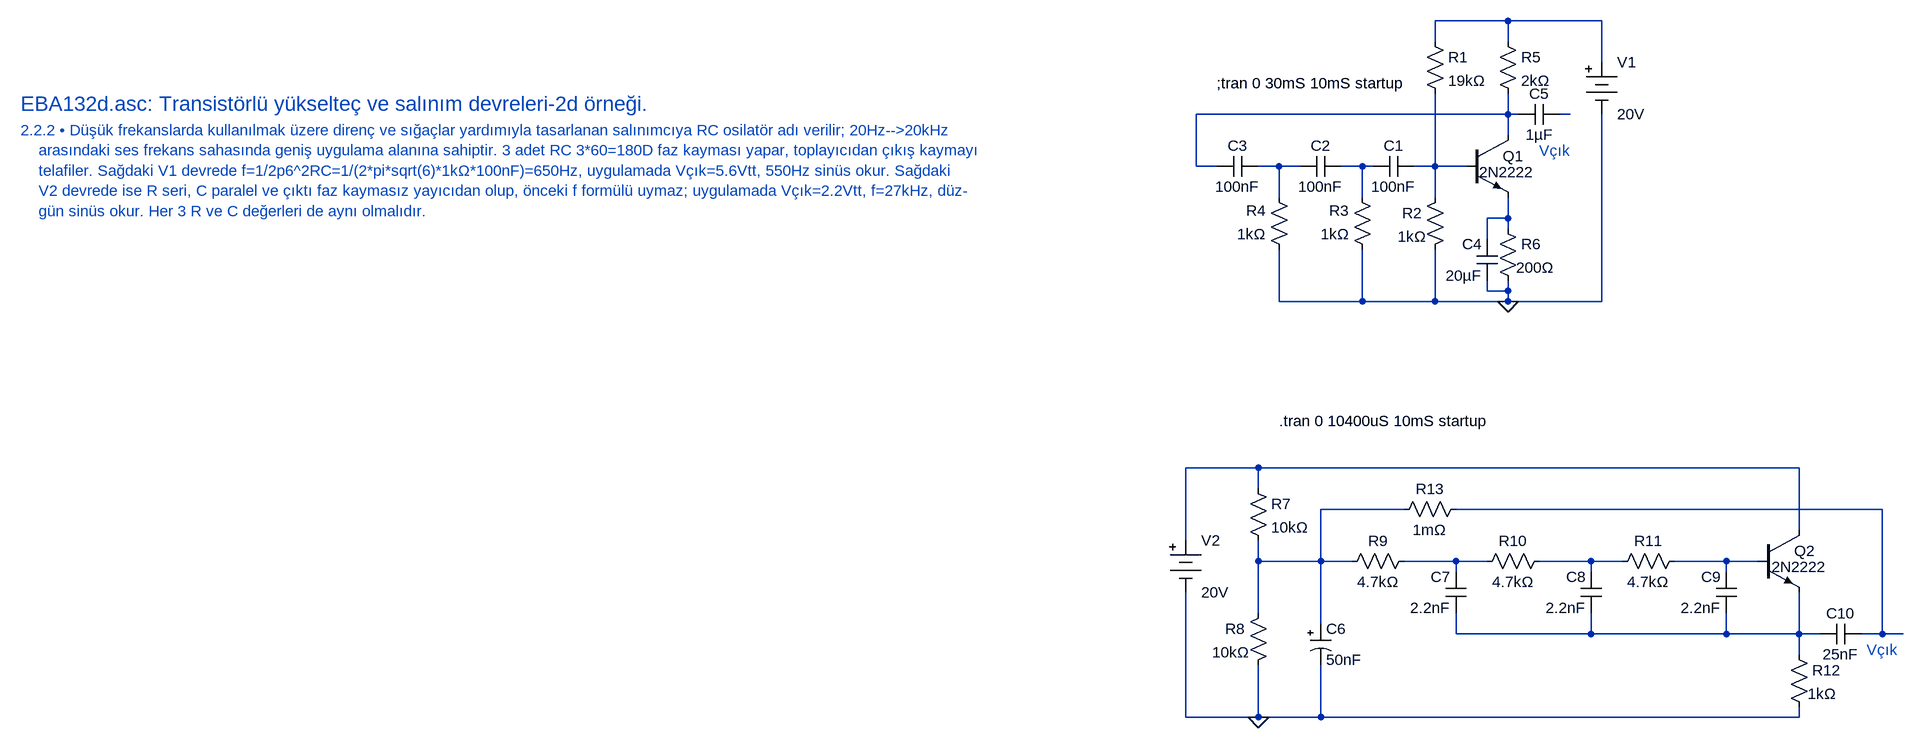
[diagram p0: schematic EBA132d.asc]
EBA132d.asc, the LTspice schematic file:
Version 4
SHEET 1 5332 4332
WIRE 2064 -80 1952 -80
WIRE 2208 -80 2064 -80
WIRE 1952 -48 1952 -80
WIRE 2064 -48 2064 -80
WIRE 2208 -16 2208 -80
WIRE 2064 64 2064 32
WIRE 2064 64 1584 64
WIRE 2080 64 2064 64
WIRE 2160 64 2144 64
WIRE 2064 96 2064 64
WIRE 1584 144 1584 64
WIRE 1616 144 1584 144
WIRE 1712 144 1680 144
WIRE 1744 144 1712 144
WIRE 1840 144 1808 144
WIRE 1856 144 1840 144
WIRE 1952 144 1952 32
WIRE 1952 144 1920 144
WIRE 2000 144 1952 144
WIRE 1712 192 1712 144
WIRE 1840 192 1840 144
WIRE 1952 192 1952 144
WIRE 2064 224 2064 192
WIRE 2064 224 2032 224
WIRE 2064 240 2064 224
WIRE 2032 256 2032 224
WIRE 2032 336 2032 320
WIRE 2064 336 2064 320
WIRE 2064 336 2032 336
WIRE 1712 352 1712 272
WIRE 1840 352 1840 272
WIRE 1840 352 1712 352
WIRE 1952 352 1952 272
WIRE 1952 352 1840 352
WIRE 2064 352 2064 336
WIRE 2064 352 1952 352
WIRE 2208 352 2208 64
WIRE 2208 352 2064 352
WIRE 1680 608 1568 608
WIRE 2512 608 1680 608
WIRE 1680 640 1680 608
WIRE 1904 672 1776 672
WIRE 2640 672 1984 672
WIRE 2512 704 2512 608
WIRE 1568 720 1568 608
WIRE 1680 752 1680 720
WIRE 1776 752 1776 672
WIRE 1776 752 1680 752
WIRE 1824 752 1776 752
WIRE 1984 752 1904 752
WIRE 2032 752 1984 752
WIRE 2192 752 2112 752
WIRE 2240 752 2192 752
WIRE 2400 752 2320 752
WIRE 2448 752 2400 752
WIRE 1984 768 1984 752
WIRE 2192 768 2192 752
WIRE 2400 768 2400 752
WIRE 1680 832 1680 752
WIRE 1776 848 1776 752
WIRE 1984 864 1984 832
WIRE 2192 864 2192 832
WIRE 2192 864 1984 864
WIRE 2400 864 2400 832
WIRE 2400 864 2192 864
WIRE 2512 864 2512 800
WIRE 2512 864 2400 864
WIRE 2544 864 2512 864
WIRE 2640 864 2640 672
WIRE 2640 864 2608 864
WIRE 2672 864 2640 864
WIRE 2512 896 2512 864
WIRE 1568 992 1568 800
WIRE 1680 992 1680 912
WIRE 1680 992 1568 992
WIRE 1776 992 1776 912
WIRE 1776 992 1680 992
WIRE 2512 992 2512 976
WIRE 2512 992 1776 992
FLAG 2064 352 0
FLAG 1680 992 0
SYMBOL npn 2000 96 R0
WINDOW 3 20 57 Left 2
SYMATTR Value 2N2222
SYMATTR InstName Q1
SYMBOL res 1936 -64 R0
SYMATTR InstName R1
SYMATTR Value 19kΩ
SYMBOL Misc\\battery 2208 -32 R0
SYMATTR InstName V1
SYMATTR Value 20V
SYMBOL res 1968 176 M0
WINDOW 3 29 76 Left 2
SYMATTR Value 1kΩ
SYMATTR InstName R2
SYMBOL res 1856 288 R180
WINDOW 0 36 76 Left 2
WINDOW 3 36 40 Left 2
SYMATTR InstName R3
SYMATTR Value 1kΩ
SYMBOL res 1728 288 R180
WINDOW 0 36 76 Left 2
WINDOW 3 36 40 Left 2
SYMATTR InstName R4
SYMATTR Value 1kΩ
SYMBOL cap 1856 128 M90
WINDOW 0 0 32 VBottom 2
WINDOW 3 32 32 VTop 2
SYMATTR InstName C1
SYMATTR Value 100nF
SYMBOL cap 1744 128 M90
WINDOW 0 0 32 VBottom 2
WINDOW 3 32 32 VTop 2
SYMATTR InstName C2
SYMATTR Value 100nF
SYMBOL cap 1616 128 M90
WINDOW 0 0 32 VBottom 2
WINDOW 3 32 32 VTop 2
SYMATTR InstName C3
SYMATTR Value 100nF
SYMBOL res 2048 -64 R0
SYMATTR InstName R5
SYMATTR Value 2kΩ
SYMBOL res 2048 224 R0
WINDOW 3 29 76 Left 2
SYMATTR Value 200Ω
SYMATTR InstName R6
SYMBOL cap 2048 256 M0
SYMATTR InstName C4
SYMATTR Value 20µF
SYMBOL cap 2080 48 M90
WINDOW 0 0 32 VBottom 2
WINDOW 3 32 32 VTop 2
SYMATTR InstName C5
SYMATTR Value 1µF
SYMBOL Misc\\battery 1568 704 R0
SYMATTR InstName V2
SYMATTR Value 20V
SYMBOL res 1664 624 R0
SYMATTR InstName R7
SYMATTR Value 10kΩ
SYMBOL res 1696 816 M0
WINDOW 3 29 76 Left 2
SYMATTR Value 10kΩ
SYMATTR InstName R8
SYMBOL polcap 1760 848 R0
SYMATTR InstName C6
SYMATTR Value 50nF
SYMBOL res 1920 736 R90
WINDOW 0 0 56 VBottom 2
WINDOW 3 32 56 VTop 2
SYMATTR InstName R9
SYMATTR Value 4.7kΩ
SYMBOL cap 2000 768 M0
SYMATTR InstName C7
SYMATTR Value 2.2nF
SYMBOL res 2128 736 R90
WINDOW 0 0 56 VBottom 2
WINDOW 3 32 56 VTop 2
SYMATTR InstName R10
SYMATTR Value 4.7kΩ
SYMBOL cap 2208 768 M0
SYMATTR InstName C8
SYMATTR Value 2.2nF
SYMBOL res 2336 736 R90
WINDOW 0 0 56 VBottom 2
WINDOW 3 32 56 VTop 2
SYMATTR InstName R11
SYMATTR Value 4.7kΩ
SYMBOL cap 2416 768 M0
SYMATTR InstName C9
SYMATTR Value 2.2nF
SYMBOL npn 2448 704 R0
WINDOW 3 22 57 Left 2
SYMATTR Value 2N2222
SYMATTR InstName Q2
SYMBOL res 2496 880 R0
WINDOW 3 29 76 Left 2
SYMATTR Value 1kΩ
SYMATTR InstName R12
SYMBOL cap 2544 848 M90
WINDOW 0 0 32 VBottom 2
WINDOW 3 32 32 VTop 2
SYMATTR InstName C10
SYMATTR Value 25nF
SYMBOL res 2000 656 R90
WINDOW 0 0 56 VBottom 2
WINDOW 3 32 56 VTop 2
SYMATTR InstName R13
SYMATTR Value 1mΩ
TEXT -224 48 Left 3 ;EBA132d.asc: Transistörlü yükselteç ve salınım devreleri-2d örneği.
TEXT -224 88 Left 2 ;2.2.2 • Düşük frekanslarda kullanılmak üzere direnç ve sığaçlar yardımıyla tasarlanan salınımcıya RC osilatör adı verilir; 20Hz-->20kHz \n    arasındaki ses frekans sahasında geniş uygulama alanına sahiptir. 3 adet RC 3*60=180D faz kayması yapar, toplayıcıdan çıkış kaymayı\n    telafiler. Sağdaki V1 devrede f=1/2p6^2RC=1/(2*pi*sqrt(6)*1kΩ*100nF)=650Hz, uygulamada Vçık=5.6Vtt, 550Hz sinüs okur. Sağdaki\n    V2 devrede ise R seri, C paralel ve çıktı faz kaymasız yayıcıdan olup, önceki f formülü uymaz; uygulamada Vçık=2.2Vtt, f=27kHz, düz-\n    gün sinüs okur. Her 3 R ve C değerleri de aynı olmalıdır.
TEXT 2112 120 Left 2 ;Vçık
TEXT 1616 16 Left 2 !;tran 0 30mS 10mS startup
TEXT 1712 536 Left 2 !.tran 0 10400uS 10mS startup
TEXT 2616 888 Left 2 ;Vçık

The netlist it stands for:
* EBA132d.asc
Q1 N002 N006 N007 0 2N2222
R1 N001 N006 19kΩ
V1 N001 0 20V
R2 N006 0 1kΩ
R3 0 N005 1kΩ
R4 0 N004 1kΩ
C1 N005 N006 100nF
C2 N004 N005 100nF
C3 N002 N004 100nF
R5 N001 N002 2kΩ
R6 N007 0 200Ω
C4 N007 0 20µF
C5 N002 N003 1µF
V2 N008 0 20V
R7 N008 N009 10kΩ
R8 N009 0 10kΩ
C6 N009 0 50nF
R9 N011 N009 4.7kΩ
C7 N011 N014 2.2nF
R10 N012 N011 4.7kΩ
C8 N012 N014 2.2nF
R11 N013 N012 4.7kΩ
C9 N013 N014 2.2nF
Q2 N008 N013 N014 0 2N2222
R12 N014 0 1kΩ
C10 N014 N010 25nF
R13 N010 N009 1mΩ
.model NPN NPN
.model PNP PNP
.lib standard.bjt
* EBA132d.asc: Transistörlü yükselteç ve salınım devreleri-2d örneği.
* 2.2.2 • Düşük frekanslarda kullanılmak üzere direnç ve sığaçlar yardımıyla tasarlanan salınımcıya RC osilatör adı verilir; 20Hz-->20kHz
*     arasındaki ses frekans sahasında geniş uygulama alanına sahiptir. 3 adet RC 3*60=180D faz kayması yapar, toplayıcıdan çıkış kaymayı
*     telafiler. Sağdaki V1 devrede f=1/2p6^2RC=1/(2*pi*sqrt(6)*1kΩ*100nF)=650Hz, uygulamada Vçık=5.6Vtt, 550Hz sinüs okur. Sağdaki
*     V2 devrede ise R seri, C paralel ve çıktı faz kaymasız yayıcıdan olup, önceki f formülü uymaz; uygulamada Vçık=2.2Vtt, f=27kHz, düz-
*     gün sinüs okur. Her 3 R ve C değerleri de aynı olmalıdır.
* Vçık
;tran 0 30mS 10mS startup
.tran 0 10400uS 10mS startup
* Vçık
.backanno
.end